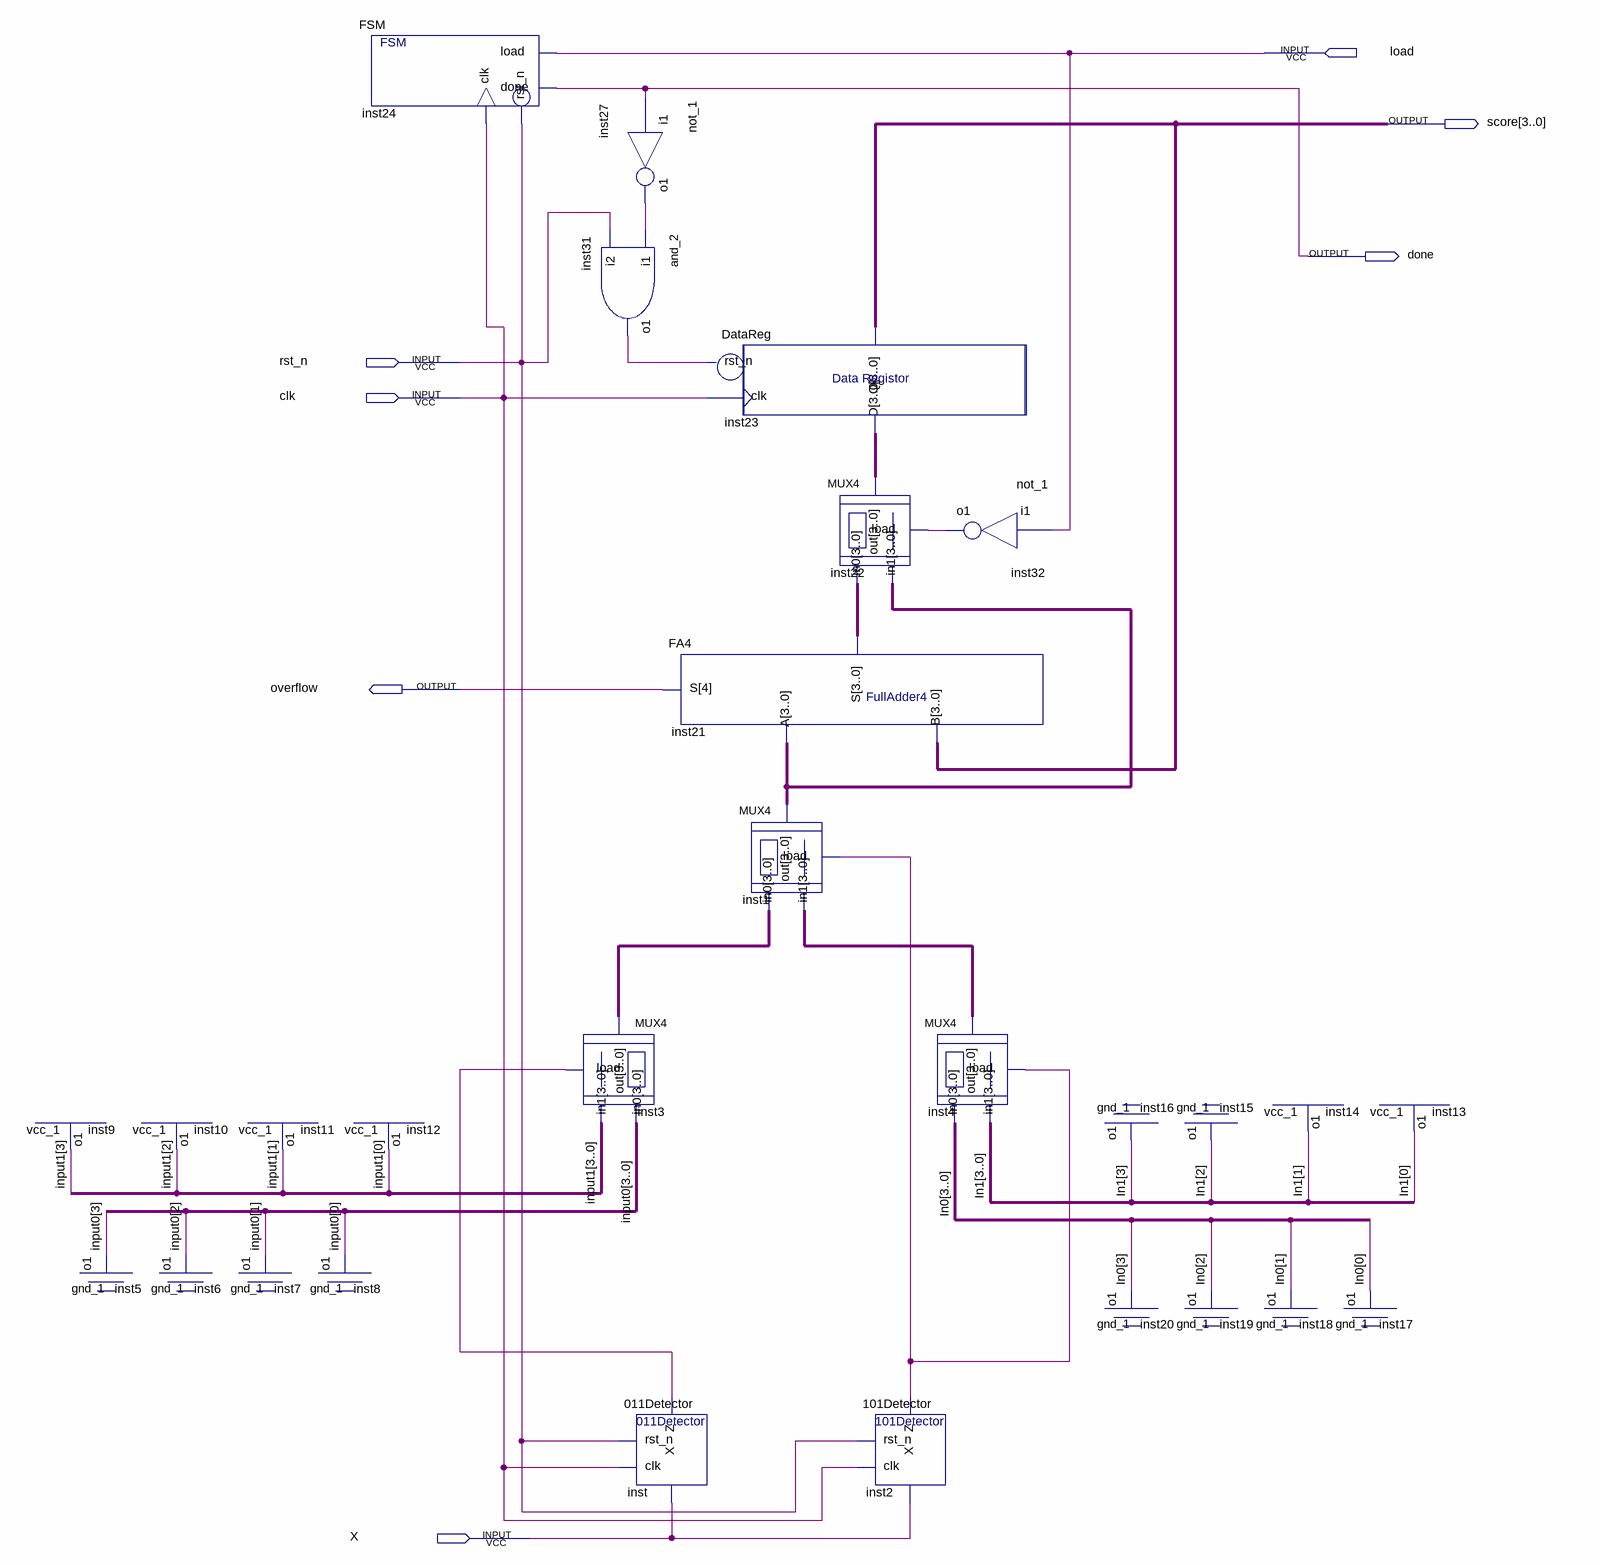
[diagram p0: schematic sheet]
// Quartus schematic WSC.bdf as structural Verilog: 28 symbols, 7 pins
module WSC (
  input  load,
  input  rst_n,
  input  clk,
  input  X,
  output [3:0] score,
  output done,
  output overflow
);

  wire inst2_z, inst27_o1, inst31_o1, inst32_o1, inst_z;
  wire [3:0] In0, In1, input0, input1, inst1_out, inst3_out, inst4_out, inst21_s, inst22_out;

  vcc_1 inst9 (.o1(input1[3]));
  vcc_1 inst10 (.o1(input1[2]));
  gnd_1 inst5 (.o1(input0[3]));
  gnd_1 inst6 (.o1(input0[2]));
  vcc_1 inst11 (.o1(input1[1]));
  gnd_1 inst7 (.o1(input0[1]));
  vcc_1 inst12 (.o1(input1[0]));
  gnd_1 inst8 (.o1(input0[0]));
  FSM inst24 (.clk(clk), .rst_n(rst_n), .load(load), .done(done));
  not_1 inst27 (.i1(done), .o1(inst27_o1));
  and_2 inst31 (.i1(inst27_o1), .i2(rst_n), .o1(inst31_o1));
  MUX4 inst3 (.in0(input0), .in1(input1), .load(inst_z), .out(inst3_out));
  \011Detector  inst (.X(X), .rst_n(rst_n), .clk(clk), .Z(inst_z));
  FA4 inst21 (.A(inst1_out), .B(score), .S({overflow, inst21_s}));
  DataReg inst23 (.rst_n(inst31_o1), .clk(clk), .D(inst22_out), .Q(score));
  MUX4 inst1 (.in0(inst3_out), .in1(inst4_out), .load(inst2_z), .out(inst1_out));
  MUX4 inst22 (.in0(inst21_s), .in1(inst1_out), .load(inst32_o1), .out(inst22_out));
  \101Detector  inst2 (.rst_n(rst_n), .clk(clk), .X(X), .Z(inst2_z));
  not_1 inst32 (.i1(load), .o1(inst32_o1));
  MUX4 inst4 (.in0(In0), .in1(In1), .load(inst2_z), .out(inst4_out));
  gnd_1 inst16 (.o1(In1[3]));
  gnd_1 inst20 (.o1(In0[3]));
  gnd_1 inst15 (.o1(In1[2]));
  gnd_1 inst19 (.o1(In0[2]));
  vcc_1 inst14 (.o1(In1[1]));
  gnd_1 inst18 (.o1(In0[1]));
  vcc_1 inst13 (.o1(In1[0]));
  gnd_1 inst17 (.o1(In0[0]));
endmodule
